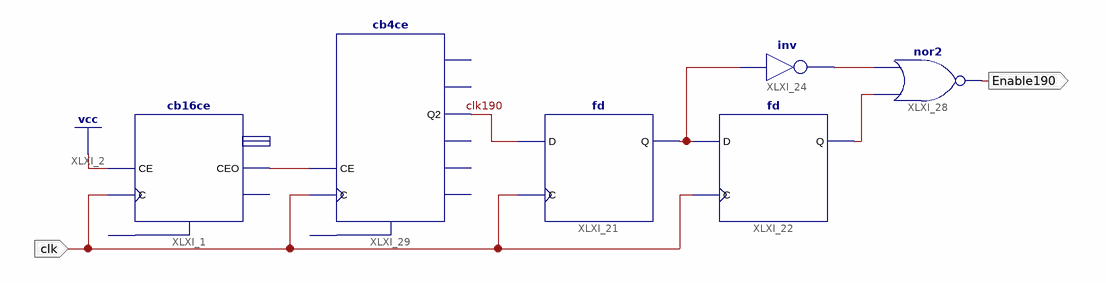
[diagram p0: schematic sheet 1]
// Xilinx ISE schematic Enable190.sch (spartan6) as structural Verilog: 6 symbols, 2 ports
module Enable190 (
  input  clk,
  output Enable190
);

  wire clk190, XLXN_14, XLXN_72, XLXN_74, XLXN_76;

  cb16ce XLXI_1 (.C(clk), .CE(1'b1), .CEO(XLXN_14));  // open: CLR, Q, TC
  fd XLXI_22 (.C(clk), .D(XLXN_74), .Q(XLXN_76));
  fd XLXI_21 (.C(clk), .D(clk190), .Q(XLXN_74));
  not XLXI_24 (XLXN_72, XLXN_74);
  nor XLXI_28 (Enable190, XLXN_76, XLXN_72);
  cb4ce XLXI_29 (.C(clk), .CE(XLXN_14), .Q2(clk190));  // open: CLR, CEO, Q0, Q1, Q3, TC
endmodule
